# Altium schematic sheet S02.SchDoc: IEEE-1394/Ethernet FPGA Controller
size 381 x 254 mm; Revision: 2.1; SheetNumber: 2; SheetTotal: 6
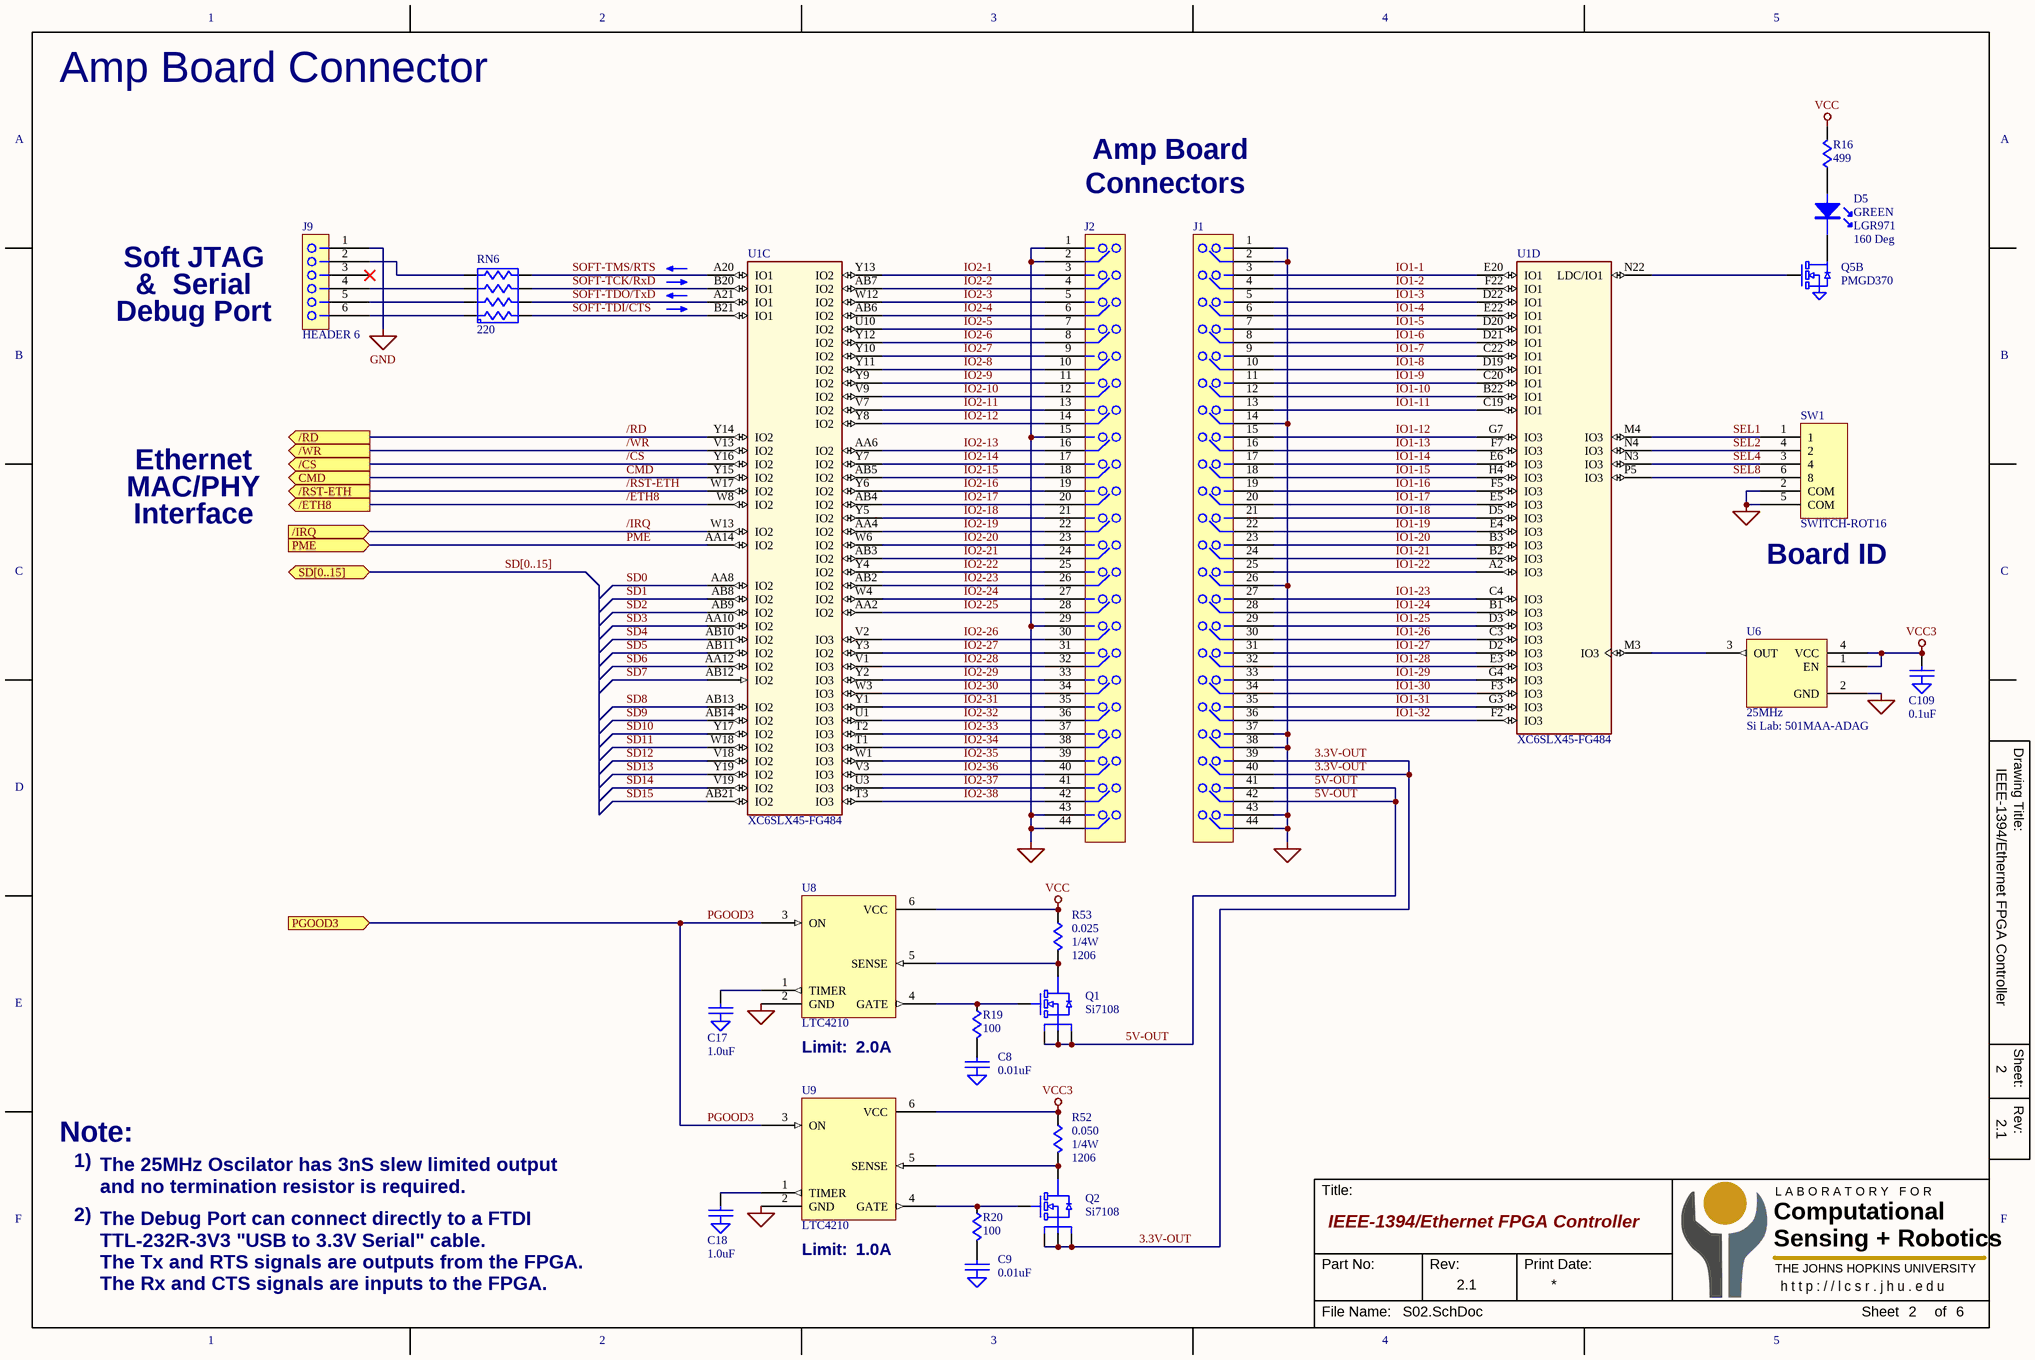
[diagram p0: S02.SchDoc]

## Parts
C8  0.01uF  [C0603]
C9  0.01uF  [C0603]
C17  1.0uF  [C0603]
C18  1.0uF  [C0603]
C109  0.1uF  [C0402]
D5  Color: GREEN  P/N: LGR971  Angle: 160 Deg  [LED-0805]  (hidden comment: LED)
J1  HEADER 22x2-1  [HDR-22x2-2MM]  (value not drawn)
J2  HEADER 22x2-1  [HDR-22x2-2MM]  (value not drawn)
J9  HEADER 6  [HDR-6x1-100]
Q1  Si7108  [PowerPak-1212]
Q2  Si7108  [PowerPak-1212]
Q5  PMGD370  [SC70-6]  (part B of 2)
R16  499  [R0603]
R19  100  [R0603]
R20  100  [R0603]
R52  0.050  Power: 1/4W  Type: 1206  [R1206]
R53  0.025  Power: 1/4W  Package: 1206  [R1206]
RN6  220  [RN-742C083]
SW1  SWITCH-ROT16  [SW-ROT-10MM-TH]
U1  XC6SLX45-FG484  [FG-484]  (parts C,D of 8)
U6  25MHz  [OSC-2x2.5mm]
U8  LTC4210  [SOT-23-6]
U9  LTC4210  [SOT-23-6]

## Ports
/CS (out), /ETH8 (out), /IRQ (in), /RD (out), /RST-ETH (out), /WR (out), CMD (out), PGOOD3 (in), PME (in), SD[0..15] (bidir)

## Nets
GND: C8.2(GND) C9.2(GND) C17.2(GND) C18.2(GND) C109.2(GND) J1.1 J1.2 J1.14 J1.26 J1.37 J1.38 J1.43 J1.44 J2.1 J2.2 J2.15 J2.29 J2.43 J2.44 J9.1 Q5.4(S2) SW1.2(COM) SW1.5(COM) U6.2(GND) U8.2(GND) U9.2(GND)
VCC: R16.2 R53.1 U8.6(VCC)
VCC3: C109.1 R52.1 U6.1(EN) U6.4(VCC) U9.6(VCC)
3.3V-OUT: J1.39 J1.40 Q2.1(S) Q2.2(S) Q2.3(S)
5V-OUT: J1.41 J1.42 Q1.1(S) Q1.2(S) Q1.3(S)
/CS: U1.Y16(IO2) ; port /CS
/ETH8: U1.W8(IO2) ; port /ETH8
/IRQ: U1.W13(IO2) ; port /IRQ
/RD: U1.Y14(IO2) ; port /RD
/RST-ETH: U1.W17(IO2) ; port /RST-ETH
/WR: U1.V13(IO2) ; port /WR
CMD: U1.Y15(IO2) ; port CMD
IO1-1: J1.3 U1.E20(IO1)
IO1-2: J1.4 U1.F22(IO1)
IO1-3: J1.5 U1.D22(IO1)
IO1-4: J1.6 U1.E22(IO1)
IO1-5: J1.7 U1.D20(IO1)
IO1-6: J1.8 U1.D21(IO1)
IO1-7: J1.9 U1.C22(IO1)
IO1-8: J1.10 U1.D19(IO1)
IO1-9: J1.11 U1.C20(IO1)
IO1-10: J1.12 U1.B22(IO1)
IO1-11: J1.13 U1.C19(IO1)
IO1-12: J1.15 U1.G7(IO3)
IO1-13: J1.16 U1.F7(IO3)
IO1-14: J1.17 U1.E6(IO3)
IO1-15: J1.18 U1.H4(IO3)
IO1-16: J1.19 U1.F5(IO3)
IO1-17: J1.20 U1.E5(IO3)
IO1-18: J1.21 U1.D5(IO3)
IO1-19: J1.22 U1.E4(IO3)
IO1-20: J1.23 U1.B3(IO3)
IO1-21: J1.24 U1.B2(IO3)
IO1-22: J1.25 U1.A2(IO3)
IO1-23: J1.27 U1.C4(IO3)
IO1-24: J1.28 U1.B1(IO3)
IO1-25: J1.29 U1.D3(IO3)
IO1-26: J1.30 U1.C3(IO3)
IO1-27: J1.31 U1.D2(IO3)
IO1-28: J1.32 U1.E3(IO3)
IO1-29: J1.33 U1.G4(IO3)
IO1-30: J1.34 U1.F3(IO3)
IO1-31: J1.35 U1.G3(IO3)
IO1-32: J1.36 U1.F2(IO3)
IO2-1: J2.3 U1.Y13(IO2)
IO2-2: J2.4 U1.AB7(IO2)
IO2-3: J2.5 U1.W12(IO2)
IO2-4: J2.6 U1.AB6(IO2)
IO2-5: J2.7 U1.U10(IO2)
IO2-6: J2.8 U1.Y12(IO2)
IO2-7: J2.9 U1.Y10(IO2)
IO2-8: J2.10 U1.Y11(IO2)
IO2-9: J2.11 U1.Y9(IO2)
IO2-10: J2.12 U1.V9(IO2)
IO2-11: J2.13 U1.V7(IO2)
IO2-12: J2.14 U1.Y8(IO2)
IO2-13: J2.16 U1.AA6(IO2)
IO2-14: J2.17 U1.Y7(IO2)
IO2-15: J2.18 U1.AB5(IO2)
IO2-16: J2.19 U1.Y6(IO2)
IO2-17: J2.20 U1.AB4(IO2)
IO2-18: J2.21 U1.Y5(IO2)
IO2-19: J2.22 U1.AA4(IO2)
IO2-20: J2.23 U1.W6(IO2)
IO2-21: J2.24 U1.AB3(IO2)
IO2-22: J2.25 U1.Y4(IO2)
IO2-23: J2.26 U1.AB2(IO2)
IO2-24: J2.27 U1.W4(IO2)
IO2-25: J2.28 U1.AA2(IO2)
IO2-26: J2.30 U1.V2(IO3)
IO2-27: J2.31 U1.Y3(IO2)
IO2-28: J2.32 U1.V1(IO3)
IO2-29: J2.33 U1.Y2(IO3)
IO2-30: J2.34 U1.W3(IO3)
IO2-31: J2.35 U1.Y1(IO3)
IO2-32: J2.36 U1.U1(IO3)
IO2-33: J2.37 U1.T2(IO3)
IO2-34: J2.38 U1.T1(IO3)
IO2-35: J2.39 U1.W1(IO3)
IO2-36: J2.40 U1.V3(IO3)
IO2-37: J2.41 U1.U3(IO3)
IO2-38: J2.42 U1.T3(IO3)
PGOOD3: U8.3(ON) U9.3(ON) ; port PGOOD3
PME: U1.AA14(IO2) ; port PME
SD0: U1.AA8(IO2)
SD1: U1.AB8(IO2)
SD2: U1.AB9(IO2)
SD3: U1.AA10(IO2)
SD4: U1.AB10(IO2)
SD5: U1.AB11(IO2)
SD6: U1.AA12(IO2)
SD7: U1.AB12(IO2)
SD8: U1.AB13(IO2)
SD9: U1.AB14(IO2)
SD10: U1.Y17(IO2)
SD11: U1.W18(IO2)
SD12: U1.V18(IO2)
SD13: U1.Y19(IO2)
SD14: U1.V19(IO2)
SD15: U1.AB21(IO2)
SEL1: SW1.1 U1.M4(IO3)
SEL2: SW1.4(2) U1.N4(IO3)
SEL4: SW1.3(4) U1.N3(IO3)
SEL8: SW1.6(8) U1.P5(IO3)
SOFT-TCK/RxD: RN6.6(R3.2) U1.B20(IO1)
SOFT-TDI/CTS: RN6.8(R1.2) U1.B21(IO1)
SOFT-TDO/TxD: RN6.7(R2.2) U1.A21(IO1)
SOFT-TMS/RTS: RN6.5(R4.2) U1.A20(IO1)
NetC8_1: C8.1 R19.2
NetC9_1: C9.1 R20.2
NetC17_1: C17.1 U8.1(TIMER)
NetC18_1: C18.1 U9.1(TIMER)
NetD5_1: D5.1(C) Q5.3(D2)
NetD5_2: D5.2(A) R16.1
NetJ9_2: J9.2 RN6.4(R4.1)
NetJ9_4: J9.4 RN6.3(R3.1)
NetJ9_5: J9.5 RN6.2(R2.1)
NetJ9_6: J9.6 RN6.1(R1)
NetQ1_4: Q1.4(G) R19.1 U8.4(GATE)
NetQ1_5: Q1.5(D) R53.2 U8.5(SENSE)
NetQ2_4: Q2.4(G) R20.1 U9.4(GATE)
NetQ2_5: Q2.5(D) R52.2 U9.5(SENSE)
NetQ5_5: Q5.5(G2) U1.N22(LDC/IO1)
NetU1_M3: U1.M3(IO3) U6.3(OUT)

Not connected (* = marked no-connect by the designer): J9 3*

## Buses and harness runs
bus SD[0..15] = port SD[0..15]

## Notes on the sheet
- Amp Board Connector
- Amp Board
- Connectors
- Soft JTAG
- &  Serial
- Debug Port
- Ethernet
- MAC/PHY
- Interface
- (near SW1) Board ID
- Limit:
- 2.0A
- Note:
- 1)
- 2)
- The 25MHz Oscilator has 3nS slew limited output and no termination resistor is required.
- The Debug Port can connect directly to a FTDI TTL-232R-3V3 "USB to 3.3V Serial" cable.
  The Tx and RTS signals are outputs from the FPGA.
  The Rx and CTS signals are inputs to the FPGA.
- (near U9) Limit:
- (near U9) 1.0A
- 1
- 2
- 3
- 4
- 5
- A
- B
- C
- Drawing Title:
- D
- E
- Sheet:
- Rev:
- F
- Title:
- Computational
- Sensing + Robotics
- L A B O R A T O R Y   F O R
- Part No:
- Print Date:
- THE JOHNS HOPKINS UNIVERSITY
- h t t p : / / l c s r . j h u . e d u
- File Name:
- Sheet
- of
- (in symbol OSCILATOR) Si Lab: 501MAA-ADAG

## Library data of the parts
C8 C9 C17 C18 C109 = CAP-GND
J1 J2 = HEADER 22x2-1: System: Connector
Q1 Q2 = MOSFET-N-PPACK
Q5 = MOSFET-N-DUAL6
R16 R52 R53 = R
R19 R20 = R-MINI
RN6 = RN-DISC-SM-4
U6 = OSCILATOR